# EAGLE schematic fasciaMainBoard_V0.1 (EAGLE 9.5.1)
NOVAXR-MAIN-BOARD: V1; REV: 1

## Sheet 1 of 2
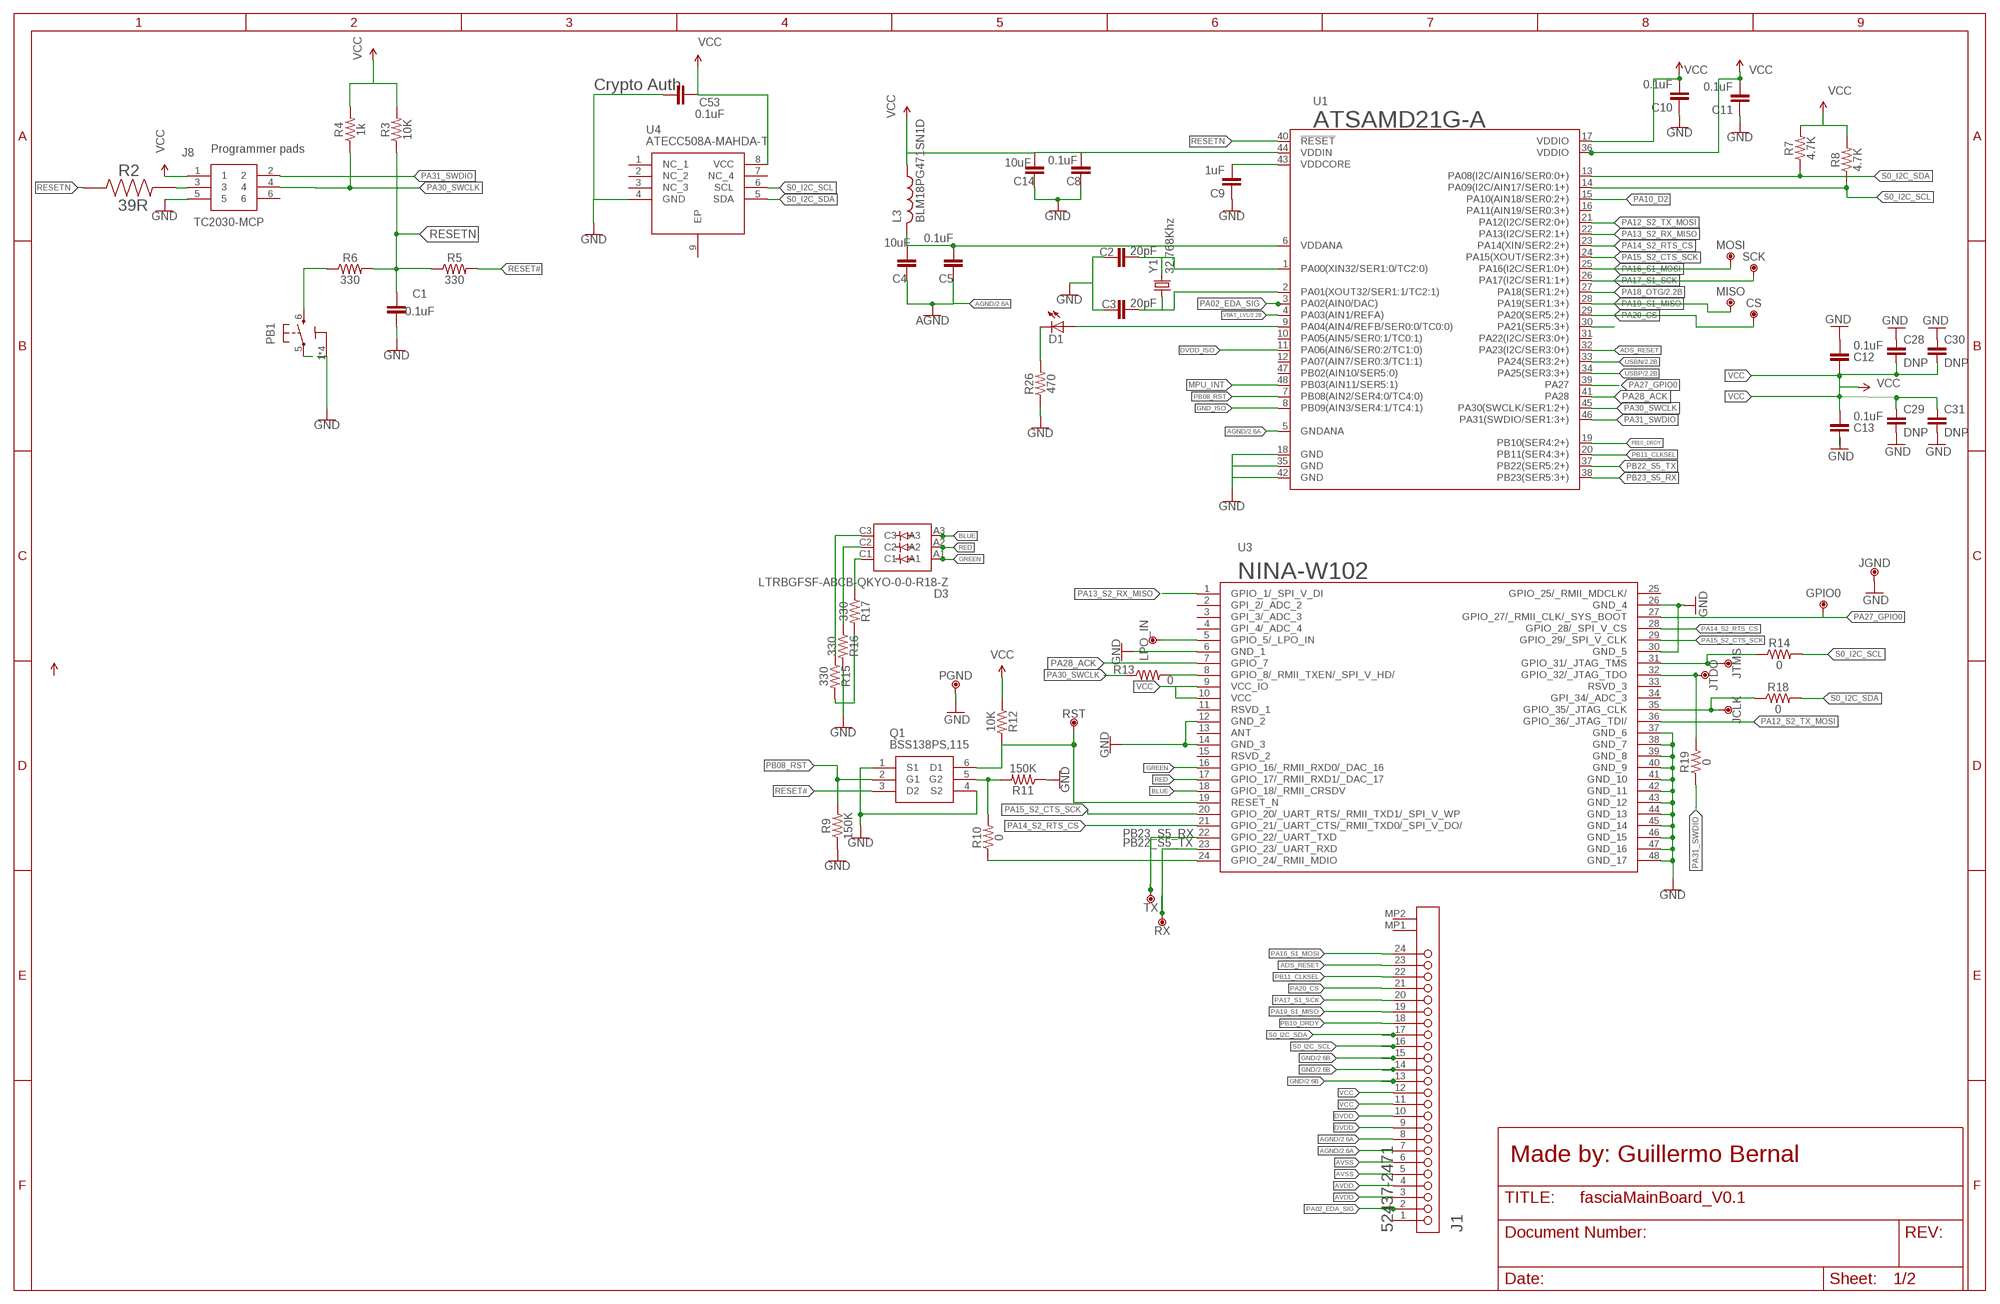
[diagram p0: schematic, sheet 1]
FRAME1 (FRAME_B_L): REV: 0

### Parts
C1  0.1uF  0.1UF-0402T-16V-10%  [0402-TIGHT]
C2  20pF  20PF-0402T-16V-10%  [0402-TIGHT]
C3  20pF  20PF-0402T-16V-10%  [0402-TIGHT]
C4  10uF  10UF-0603-6.3V-20%  [0603]
C5  0.1uF  0.1UF-0402T-16V-10%  [0402-TIGHT]
C8  0.1uF  0.1UF-0402T-16V-10%  [0402-TIGHT]
C9  1uF  1UF-0402T-16V-10%  [0402-TIGHT]
C10  0.1uF  0.1UF-0402T-16V-10%  [0402-TIGHT]
C11  0.1uF  0.1UF-0402T-16V-10%  [0402-TIGHT]
C12  0.1uF  0.1UF-0402T-16V-10%  [0402-TIGHT]
C13  0.1uF  0.1UF-0402T-16V-10%  [0402-TIGHT]
C14  10uF  10UF-0603-6.3V-20%  [0603]
C28  DNP  CDNP-0402  [0402-1005X55N]
C29  DNP  CDNP-0402  [0402-1005X55N]
C30  DNP  C-DNP-0603  [0603-1608X90N]
C31  DNP  C-DNP-0603  [0603-1608X90N]
C53  0.1uF  0.1UF-0402T-16V-10%  [0402-TIGHT]
CS  DNP  TPTP-0.8MM  [TP-0.8MM]
D1  LEDCHIPLED_0603  [CHIPLED_0603]
D3  LTRBGFSF-ABCB-QKYO-0-0-R18-Z  [PLCC-6]
GPIO0  DNP  TPTP-0.8MM  [TP-0.8MM]
J1  MOLEX_52437-2471MOLEX_52437-2471_0_0  [MOLEX_52437-2471_0]
J8  TC2030-MCP  [TC2030MCP]
JCLK  DNP  TPTP-0.8MM  [TP-0.8MM]
JGND  DNP  TPTP-0.8MM  [TP-0.8MM]
JTDO  DNP  TPTP-0.8MM  [TP-0.8MM]
JTMS  DNP  TPTP-0.8MM  [TP-0.8MM]
L3  BLM18PG471SN1D  [BEADC1608X95N]
LPO_IN  DNP  TPTP-0.8MM  [TP-0.8MM]
MISO  DNP  TPTP-0.8MM  [TP-0.8MM]
MOSI  DNP  TPTP-0.8MM  [TP-0.8MM]
PB1  PTS820  TACTILE1PTS820-NH  [C&K_PTS820_NO_HOLES]
PGND  DNP  TPTP-0.8MM  [TP-0.8MM]
Q1  BSS138PS,115  [SOT65P210X110-6N]
R2  39R  RC0402FR-0739RL  [RESC1005X40N]
R3  10K  [0402-TIGHT]
R4  1k  1K  [0402-TIGHT]
R5  330  [0402-TIGHT]
R6  330  [0402-TIGHT]
R7  4.7K  [0402-TIGHT]
R8  4.7K  [0402-TIGHT]
R9  150K  100K  [0402-TIGHT]
R10  0  [0402-TIGHT]
R11  150K  100K  [0402-TIGHT]
R12  10K  [0402-TIGHT]
R13  0  [0402-TIGHT]
R14  0  [0402-TIGHT]
R15  330  [0402-TIGHT]
R16  330  [0402-TIGHT]
R17  330  [0402-TIGHT]
R18  0  [0402-TIGHT]
R19  0  [0402-TIGHT]
R26  470  [0402-TIGHT]
RST  DNP  TPTP-0.8MM  [TP-0.8MM]
RX  DNP  TPTP-0.8MM  [TP-0.8MM]
SCK  DNP  TPTP-0.8MM  [TP-0.8MM]
TX  DNP  TPTP-0.8MM  [TP-0.8MM]
U1  ATSAMD21G-A  [TQFP-48]
U3  NINA-W102  [NINAW102]
U4  ATECC508A-MAHDA-T  [SON50P300X200X60-9N]
Y1  32.768Khz  ECS-.327-12.5-34B-TR  [ECX-31B]

### Nets
ADS_RESET: J1.23 U1.32(PA23(I2C/SER3:0+))
AGND: C4.1 C5.1 J1.7 J1.8 U1.5(GNDANA) ; also sheet 2
AVDD: J1.3 J1.4 ; also sheet 2
AVSS: J1.5 J1.6 ; also sheet 2
BLUE: D3.A3 U3.18(GPIO_18/_RMII_CRSDV)
DVDD: J1.9 J1.10 ; also sheet 2
DVDD_ISO: U1.11(PA06(AIN6/SER0:2/TC1:0))
GND: C1.2 C2.1 C3.1 C8.1 C9.1 C10.1 C11.1 C12.2 C13.1 C14.1 C28.1 C29.2 C30.1 C31.2 C53.2 J1.13 J1.14 J1.15 J8.5 JGND.X PB1.1 PB1.2 PB1.3 PB1.4 PB1.5 PGND.X Q1.1(S1) Q1.4(S2) R9.1 R11.1 R15.2 R16.2 R17.2 R26.1 U1.18(GND) U1.35(GND) U1.42(GND) U3.6(GND_1) U3.12(GND_2) U3.14(GND_3) U3.26(GND_4) U3.30(GND_5) U3.37(GND_6) U3.38(GND_7) U3.39(GND_8) U3.40(GND_9) U3.41(GND_10) U3.42(GND_11) U3.43(GND_12) U3.44(GND_13) U3.45(GND_14) U3.46(GND_15) U3.47(GND_16) U3.48(GND_17) U4.4(GND) ; also sheet 2
GND_ISO: U1.8(PB09(AIN3/SER4:1/TC4:1))
GREEN: D3.A1 U3.16(GPIO_16/_RMII_RXD0/_DAC_16)
MPU_INT: U1.48(PB03(AIN11/SER5:1))
N$1: J8.3 R2.2
N$3: PB1.6 R6.1
N$4: C2.2 U1.1(PA00(XIN32/SER1:0/TC2:0)) Y1.2
N$6: C3.2 U1.2(PA01(XOUT32/SER1:1/TC2:1)) Y1.1
N$8: Q1.5(G2) R10.2 R11.2
N$9: R10.1 U3.24(GPIO_24/_RMII_MDIO)
N$10: C9.2 U1.43(VDDCORE)
N$11: R13.2 U3.8(GPIO_8/_RMII_TXEN/_SPI_V_HD/)
N$12: Q1.6(D1) R12.2 RST.X U3.19(RESET_N)
N$13: D1.C R26.2
N$15: D1.A U1.9(PA04(AIN4/REFB/SER0:0/TC0:0))
N$16: D3.C1 R17.1
N$17: D3.C2 R16.1
N$18: D3.C3 R15.1
N$19: JTMS.X R14.1 U3.31(GPIO_31/_JTAG_TMS)
N$20: JTDO.X R19.2 U3.32(GPIO_32/_JTAG_TDO)
N$21: JCLK.X R18.1 U3.35(GPIO_35/_JTAG_CLK)
N$23: LPO_IN.X U3.5(GPIO_5/_LPO_IN)
PA02_EDA_SIG: J1.2 U1.3(PA02(AIN0/DAC))
PA10_D2: U1.15(PA10(AIN18/SER0:2+))
PA12_S2_TX_MOSI: U1.21(PA12(I2C/SER2:0+)) U3.36(GPIO_36/_JTAG_TDI/)
PA13_S2_RX_MISO: U1.22(PA13(I2C/SER2:1+)) U3.1(GPIO_1/_SPI_V_DI)
PA14_S2_RTS_CS: U1.23(PA14(XIN/SER2:2+)) U3.21(GPIO_21/_UART_CTS/_RMII_TXD0/_SPI_V_DO/) U3.28(GPIO_28/_SPI_V_CS)
PA15_S2_CTS_SCK: U1.24(PA15(XOUT/SER2:3+)) U3.20(GPIO_20/_UART_RTS/_RMII_TXD1/_SPI_V_WP) U3.29(GPIO_29/_SPI_V_CLK)
PA16_S1_MOSI: J1.24 MOSI.X U1.25(PA16(I2C/SER1:0+))
PA17_S1_SCK: J1.20 SCK.X U1.26(PA17(I2C/SER1:1+))
PA18_OTG: U1.27(PA18(SER1:2+)) ; also sheet 2
PA19_S1_MISO: J1.19 MISO.X U1.28(PA19(SER1:3+))
PA20_CS: CS.X J1.21 U1.29(PA20(SER5:2+))
PA21_CS1: U1.30(PA21(SER5:3+))
PA27_GPIO0: GPIO0.X U1.39(PA27) U3.27(GPIO_27/_RMII_CLK/_SYS_BOOT)
PA28_ACK: U1.41(PA28) U3.7(GPIO_7)
PA30_SWCLK: J8.4 R4.1 R13.1 U1.45(PA30(SWCLK/SER1:2+))
PA31_SWDIO: J8.2 R19.1 U1.46(PA31(SWDIO/SER1:3+))
PB08_RST: Q1.2(G1) R9.2 U1.7(PB08(AIN2/SER4:0/TC4:0))
PB10_DRDY: J1.18 U1.19(PB10(SER4:2+))
PB11_CLKSEL: J1.22 U1.20(PB11(SER4:3+))
PB22_S5_TX: RX.X U1.37(PB22(SER5:2+)) U3.23(GPIO_23/_UART_RXD)
PB23_S5_RX: TX.X U1.38(PB23(SER5:3+)) U3.22(GPIO_22/_UART_TXD)
RED: D3.A2 U3.17(GPIO_17/_RMII_RXD1/_DAC_17)
RESET#: Q1.3(D2) R5.2
RESETN: C1.1 R2.1 R3.1 R5.1 R6.2 U1.40(!RESET!)
S0_I2C_SCL: J1.16 R8.1 R14.2 U1.14(PA09(I2C/AIN17/SER0:1+)) U4.6(SCL)
S0_I2C_SDA: J1.17 R7.1 R18.2 U1.13(PA08(I2C/AIN16/SER0:0+)) U4.5(SDA)
USBN: U1.33(PA24(SER3:2+)) ; also sheet 2
USBP: U1.34(PA25(SER3:3+)) ; also sheet 2
VBAT_LVL: U1.4(PA03(AIN1/REFA)) ; also sheet 2
VCC: C8.2 C10.2 C11.2 C12.1 C13.2 C14.2 C28.2 C29.1 C30.2 C31.1 C53.1 J1.11 J1.12 J8.1 L3.1 R3.2 R4.2 R7.2 R8.2 R12.1 U1.17(VDDIO) U1.36(VDDIO) U1.44(VDDIN) U3.9(VCC_IO) U3.10(VCC) U4.8(VCC) ; also sheet 2
VDDANA: C4.2 C5.2 L3.2 U1.6(VDDANA)
Unconnected: J1.1 J1.MP1 J1.MP2 J8.6 U1.10(PA05(AIN5/SER0:1/TC0:1)) U1.12(PA07(AIN7/SER0:3/TC1:1)) U1.16(PA11(AIN19/SER0:3+)) U1.31(PA22(I2C/SER3:0+)) U1.47(PB02(AIN10/SER5:0)) U3.2(GPI_2/_ADC_2) U3.3(GPI_3/_ADC_3) U3.4(GPI_4/_ADC_4) U3.11(RSVD_1) U3.13(ANT) U3.15(RSVD_2) U3.25(GPIO_25/_RMII_MDCLK/) U3.33(RSVD_3) U3.34(GPI_34/_ADC_3) U4.1(NC_1) U4.2(NC_2) U4.3(NC_3) U4.7(NC_4) U4.9(EP)

### Notes on the sheet
- Crypto Auth
- Programmer pads
- Made by: Guillermo Bernal

## Sheet 2 of 2
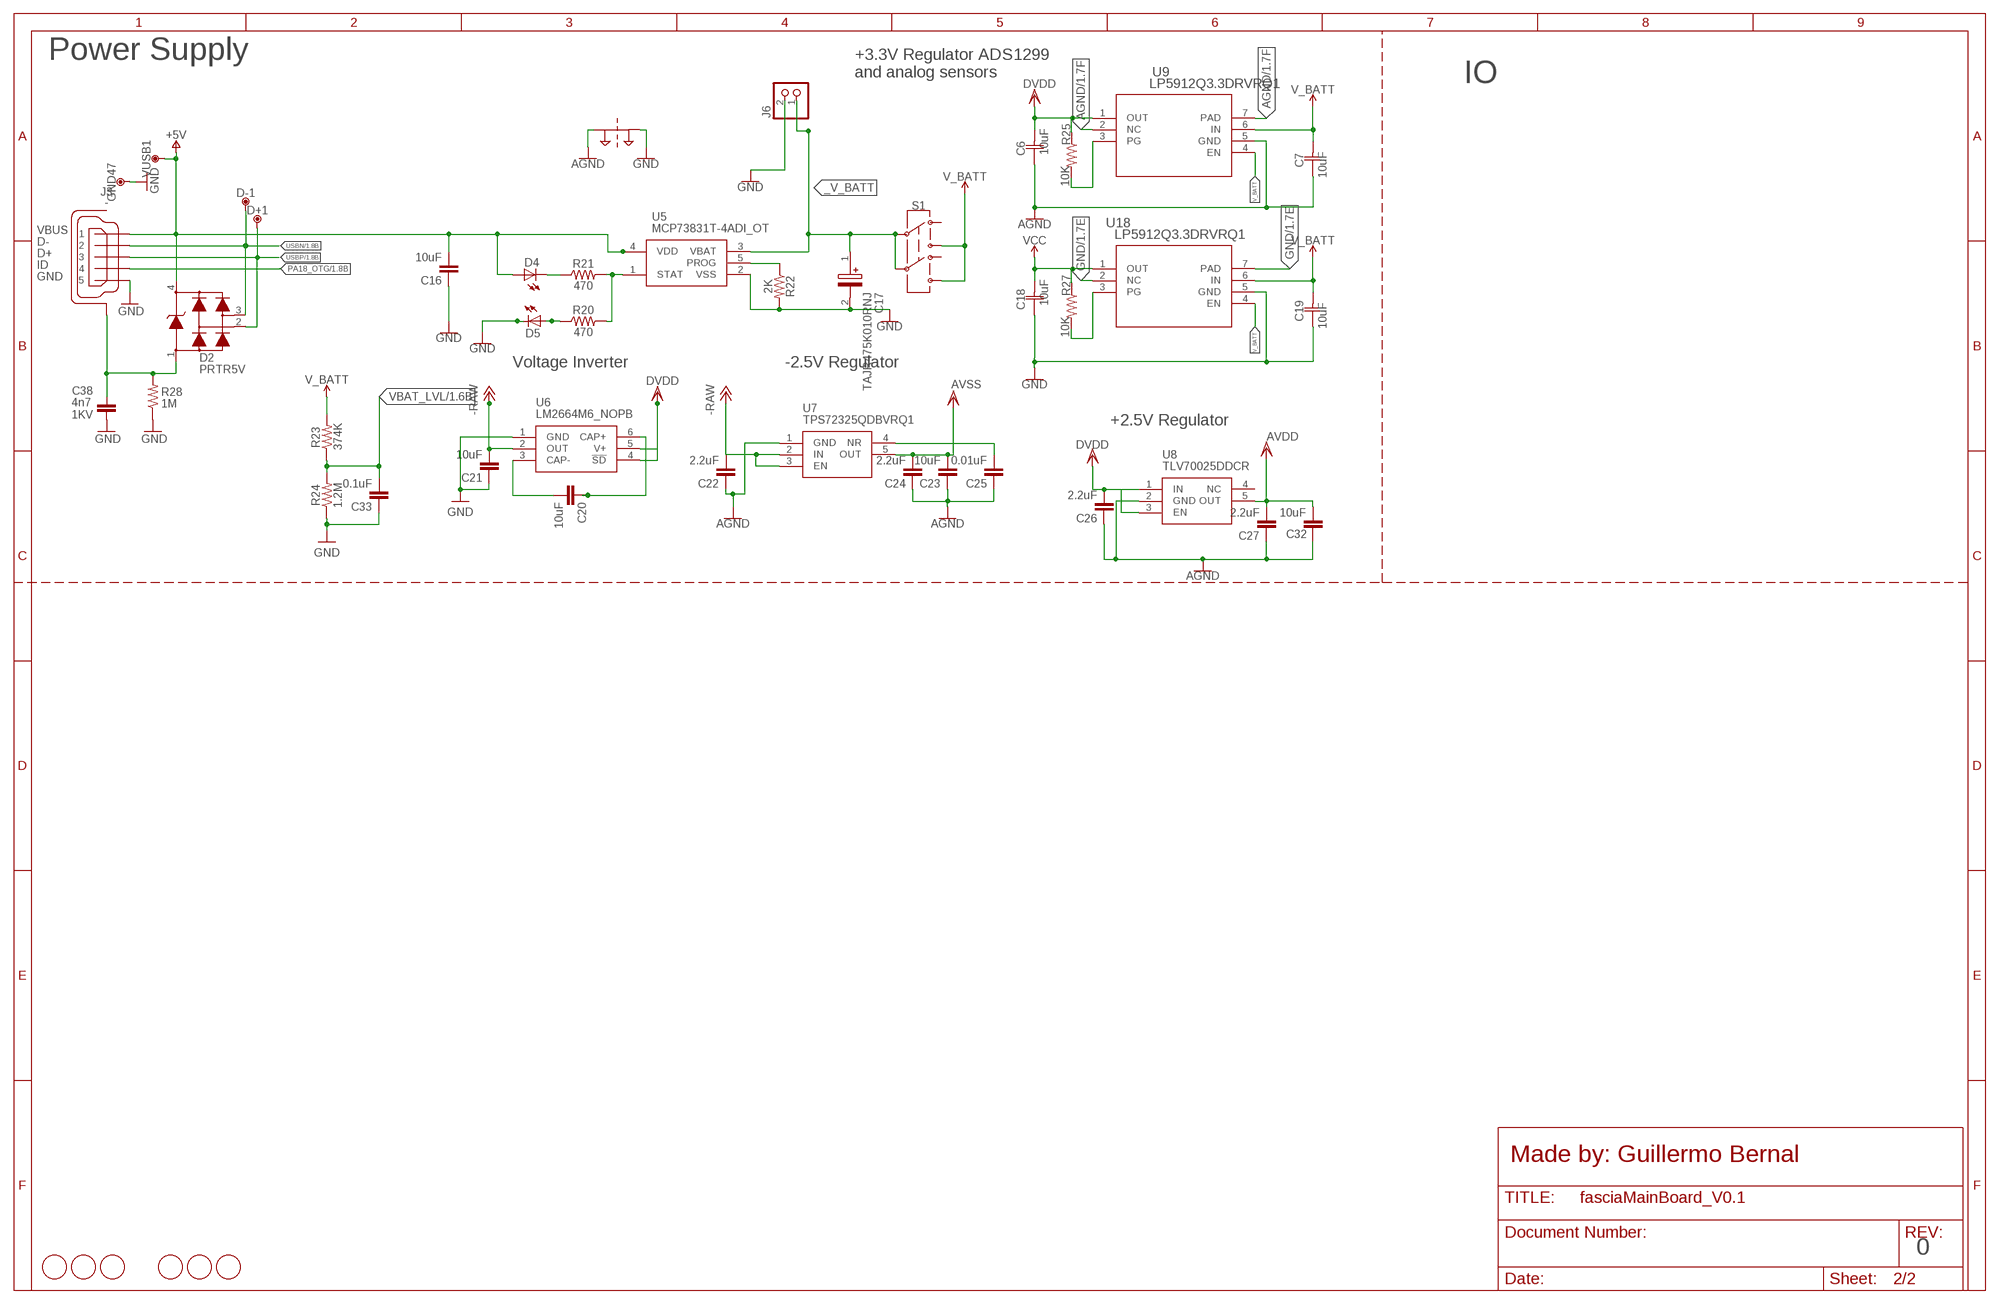
[diagram p1: schematic, sheet 2]
FRAME2 (FRAME_B_L): REV: 0

### Parts
C6  10uF  CL10B106MQ8NRNCCAP_CL10-L  [CAP_CL10-L]
C7  10uF  CL10B106MQ8NRNCCAP_CL10-L  [CAP_CL10-L]
C16  10uF  10UF-0603-6.3V-20%  [0603]
C17  TAJR475K010RNJ  [CAPPM2014X120N]
C18  10uF  CL10B106MQ8NRNCCAP_CL10-L  [CAP_CL10-L]
C19  10uF  CL10B106MQ8NRNCCAP_CL10-L  [CAP_CL10-L]
C20  10uF  10UF-0603-6.3V-20%  [0603]
C21  10uF  10UF-0603-6.3V-20%  [0603]
C22  2.2uF  2.2UF-0402T-16V-10%  [0402-TIGHT]
C23  10uF  10UF-0603-6.3V-20%  [0603]
C24  2.2uF  2.2UF-0402T-16V-10%  [0402-TIGHT]
C25  0.01uF  0.01UF-0402T-16V-10%  [0402-TIGHT]
C26  2.2uF  2.2UF-0402T-16V-10%  [0402-TIGHT]
C27  2.2uF  2.2UF-0402T-16V-10%  [0402-TIGHT]
C32  10uF  10UF-0603-6.3V-20%  [0603]
C33  0.1uF  0.1UF-0402T-16V-10%  [0402-TIGHT]
C38  4n7  C4.7NF-0805  [0805-R2013X50N]
D2  PRTR5V  PRTR5V0U2X,215  [SOT190P230X110-4N]
D4  LEDCHIPLED_0603  [CHIPLED_0603]
D5  LEDCHIPLED_0603  [CHIPLED_0603]
D+1  DNP  TPTP-1.00MM  [TP-1.00MM]
D-1  DNP  TPTP-1.00MM  [TP-1.00MM]
FD1  DNP  FIDUCIAL-1.5MM  [FD-1-1.5]
FD2  DNP  FIDUCIAL-1.5MM  [FD-1-1.5]
FD3  DNP  FIDUCIAL-1.5MM  [FD-1-1.5]
FD4  DNP  FIDUCIAL-1.5MM  [FD-1-1.5]
FD5  DNP  FIDUCIAL-1.5MM  [FD-1-1.5]
FD6  DNP  FIDUCIAL-1.5MM  [FD-1-1.5]
GND47  DNP  TPTP-1.00MM  [TP-1.00MM]
J3  -  USB-MICRO  [ZX62-AB-5PA]
J6  JST_2PIN-SMT-RA  [JST-PH-2-SMT-RA]
R20  470  [0402-TIGHT]
R21  470  [0402-TIGHT]
R22  2K  [0402-TIGHT]
R23  374K  [0402-TIGHT]
R24  1.2M  1.2M-0402-1/10W-1%  [0402]
R25  10K  [0402-TIGHT]
R27  10K  [0402-TIGHT]
R28  1M  [0402-TIGHT]
S1  SWITCH-DPDT-SMD-AYZ0202  [SWITCH_DPDT_SMD_AYZ0202]
SUPPLY1  2PT_GND_TIE  [2PT_GND_TIE]
U5  MCP73831T-4ADI_OT  [SOT95P270X145-5N]
U6  LM2664M6_NOPB  [SOT95P280X145-6N]
U7  TPS72325QDBVRQ1  [SOT96P230X110-5N]
U8  TLV70025DDCR  [SOT95P280X110-5N]
U9  LP5912Q3.3DRVRQ1  [DRV0006A]
U18  LP5912Q3.3DRVRQ1  [DRV0006A]
VUSB1  DNP  TPTP-1.00MM  [TP-1.00MM]

### Nets
+5V: C16.2 D2.4 D4.A J3.1 U5.4(VDD) VUSB1.X
-RAW: C21.2 C22.2 U6.2(OUT) U7.2(IN) U7.3(EN)
_V_BATT: C17.1(+) J6.1 S1.2 S1.5 U5.3(VBAT)
AGND: C6.1 C7.1 C22.1 C23.1 C24.1 C25.1 C26.1 C27.1 C32.1 SUPPLY1.P$1 U7.1(GND) U8.2(GND) U9.2(NC) U9.5(GND) U9.7(PAD) ; also sheet 1
AVDD: C27.2 C32.2 U8.5(OUT) ; also sheet 1
AVSS: C23.2 C24.2 U7.5(OUT) ; also sheet 1
DVDD: C6.2 C26.2 R25.1 U6.4(!SD) U6.5(V+) U8.1(IN) U8.3(EN) U9.1(OUT) ; also sheet 1
GND: C16.1 C17.2(-) C18.1 C19.1 C21.1 C33.1 C38.2 D5.C GND47.X J3.5 J6.2 R22.2 R24.1 R28.1 SUPPLY1.P$2 U5.2(VSS) U6.1(GND) U18.2(NC) U18.5(GND) U18.7(PAD) ; also sheet 1
N$2: R27.2 U18.3(PG)
N$7: R25.2 U9.3(PG)
N$25: D4.C R21.1
N$28: R20.2 R21.2 U5.1(STAT)
N$30: R22.1 U5.5(PROG)
N$31: C20.2 U6.3(CAP-)
N$32: C20.1 U6.6(CAP+)
N$33: C25.2 U7.4(NR)
N$40: C38.1 D2.1 J3.6(SH) J3.7(SH) J3.8(SH) J3.9(SH) J3.10(SH) J3.11(SH) R28.2
N$42: D5.A R20.1
PA18_OTG: J3.4 ; also sheet 1
USBN: D2.3 D-1.X J3.2 ; also sheet 1
USBP: D2.2 D+1.X J3.3 ; also sheet 1
V_BATT: C7.2 C19.2 R23.2 S1.3 S1.6 U9.4(EN) U9.6(IN) U18.4(EN) U18.6(IN)
VBAT_LVL: C33.2 R23.1 R24.2 ; also sheet 1
VCC: C18.2 R27.1 U18.1(OUT) ; also sheet 1
Unconnected: S1.1 S1.4 U8.4(NC)

### Notes on the sheet
- Power Supply
- +3.3V Regulator ADS1299 
  and analog sensors
- IO
- Voltage Inverter | -2.5V Regulator
- +2.5V Regulator
- 374K
- Made by: Guillermo Bernal

## Library data of the parts
C1 C5 C8 C10-C13 C33 C53 = novaXR:0.1UF: 0.1µF ceramic capacitors A capacitor is a passive two-terminal electrical component used to store electrical energy temporarily in an electric field.; PROD_ID: CAP-12416
C2 C3 = novaXR:20PF: 20pF ceramic capacitors A capacitor is a passive two-terminal electrical component used to store electrical energy temporarily in an electric field.; PROD_ID: CAP-12416; VALUE: 0.1uF
C4 C14 C16 C20 C21 C23 C32 = SparkFun-Capacitors:10UF: 10.0µF ceramic capacitors A capacitor is a passive two-terminal electrical component used to store electrical energy temporarily in an electric field.; PROD_ID: CAP-11015
C6 C7 C18 C19 = Lp5912Q3.3DRV:CL10B106MQ8NRNC; MANUFACTURER_PART_NUMBER: CL10B106MQ8NRNC; VENDOR: Samsung
C9 = novaXR:1UF: 1µF ceramic capacitors A capacitor is a passive two-terminal electrical component used to store electrical energy temporarily in an electric field.; PROD_ID: CAP-12416
C17 = SamacSys_Parts:TAJR475K010RNJ: AVX 4.7uF SMD Solid MnO2 Tantalum Electrolytic Capacitor, 10 V dc +/-10%, TAJ Series Source: Datasheet <http://www.farnell.com/datasheets/1680476.pdf>; ALLIED_NUMBER: 70475142; ALLIED_PRICE-STOCK: https://www.alliedelec.com/avx-tajr475k010rnj/70475142/; DESCRIPTION: AVX 4.7uF SMD Solid MnO2 Tantalum Electrolytic Capacitor, 10 V dc +/-10%, TAJ Series; HEIGHT: 1.2mm; MANUFACTURER_NAME: AVX; MANUFACTURER_PART_NUMBER: TAJR475K010RNJ; MOUSER_PART_NUMBER: 581-TAJR475K010R; MOUSER_PRICE-STOCK: https://www.mouser.com/Search/Refine.aspx?Keyword=581-TAJR475K010R; RS_PART_NUMBER: 1355409P; RS_PRICE-STOCK: http://uk.rs-online.com/web/p/products/1355409P
C22 C24 C26 C27 = novaXR:2.2UF: 2.2uF ceramic capacitors A capacitor is a passive two-terminal electrical component used to store electrical energy temporarily in an electric field.; PROD_ID: CAP-12416
C25 = novaXR:0.01UF: 0.01µF ceramic capacitors A capacitor is a passive two-terminal electrical component used to store electrical energy temporarily in an electric field.; PROD_ID: CAP-12416
C28-C31 = Arduino-rcl:C: SMD Capacitor; CODE-ARDUINO: DNP; DATASHEET: DNP; DISTRIBUTOR-LINK: DNP; DISTRIBUTOR-PN: DNP; MANUFACTURER: DNP; MANUFACTURER-PN: DNP
C38 = Arduino-rcl:C: SMD Capacitor; CODE-ARDUINO: 0689; DATASHEET: http://www.kemet.com/Lists/ProductCatalog/Attachments/40/KEM_C1010_X7R_HV_SMD.pdf; DISTRIBUTOR-LINK: www.kemet.com/docfinder?Partnumber=C0805C472KDRACTU; DISTRIBUTOR-PN: 399-6738-1-ND; MANUFACTURER: Kemet; MANUFACTURER-PN: C0805C472KDRACTU; VOLTAGE: 1KV
CS D+1 D-1 GND47 GPIO0 JCLK JGND JTDO JTMS LPO_IN MISO MOSI PGND RST RX SCK TX VUSB1 = Arduino-utility:TP: Testpoint; CODE-ARDUINO: DNP; DATASHEET: DNP; DISTRIBUTOR-LINK: DNP; DISTRIBUTOR-PN: DNP; MANUFACTURER: DNP; MANUFACTURER-PN: DNP
D1 D4 D5 = adafruit:LED: LED OSRAM: - CHIPLED LG R971, LG N971, LY N971, LG Q971, LY Q971, LO R971, LY R971 LH N974, LH R974 LS Q976, LO Q976, LY Q976 LO Q996 - Hyper CHIPLED LW Q18S LB Q993, LB Q99A, LB R99A - SideLED LS A670, LO A670, LY A670, LG A670, LP A670 LB A673, LV A673, LT A673, LW A673 LH A674 LY A675 LS A676, LA A676, LO A676, LY A676, LW A676 LS A679, LY A679, LG A679 - Hyper Micro SIDELED® LS Y876, LA Y876, LO Y876, LY Y876 LT Y87S - SmartLED LW L88C, LW L88S LB L89C, LB L89S, LG L890 LS L89K, LO L89K, LY L89K LS L896, LA L896, LO L896, LY L896 - TOPLED LS T670, LO T670, LY T670, LG T670, LP T670 LSG T670, LSP T670, LSY T670, LOP T670, LYG T670 LG T671, LOG T671, LSG T671 LB T673, LV T673, LT T673, LW T673 LH T674 LS T676, LA T676, LO T676, LY T676, LB T676, LH T676, LSB T676, LW T676 LB T67C, LV T67C, LT T67C, LS T67K, LO T67K, LY T67K, LW E67C LS E67B, LA E67B, LO E67B, LY E67B, LB E67C, LV E67C, LT E67C LW T67C LS T679, LY T679, LG T679 LS T770, LO T770, LY T770, LG T770, LP T770 LB T773, LV T773, LT T773, LW T773 LH T774 LS E675, LA E675, LY E675, LS T675 LS T776, LA T776, LO T776, LY T776, LB T776 LHGB T686 LT T68C, LB T68C - Hyper Mini TOPLED® LB M676 - Mini TOPLED Santana® LG M470 LS M47K, LO M47K, LY M47K Source: http://www.osram.convergy.de/
D2 = Arduino-diodes:PRTR5V0U2X,215: USB ESD protection; CODE-ARDUINO: 2209; DATASHEET: http://www.nxp.com/documents/data_sheet/PRTR5V0U2X.pdf; DISTRIBUTOR-LINK: http://www.digikey.com/product-detail/en/nxp-semiconductors/PRTR5V0U2X,215/568-4140-1-ND/1589981; DISTRIBUTOR-PN: 568-4140-1-ND; MANUFACTURER: NXP; MANUFACTURER-PN: PRTR5V0U2X,215
D3 = SamacSys_Parts:LTRBGFSF-ABCB-QKYO-0-0-R18-Z: LED RGB DIFFUSED 6SMD Source: Datasheet <https://dammedia.osram.info/media/resource/hires/osram-dam-2493400/LTRB GFSF.pdf>; DESCRIPTION: LED RGB DIFFUSED 6SMD; HEIGHT: mm; MANUFACTURER_NAME: OSRAM Opto Semiconductors; MANUFACTURER_PART_NUMBER: LTRBGFSF-ABCB-QKYO-0-0-R18-Z; MOUSER_PART_NUMBER: N/A; MOUSER_PRICE-STOCK: https://www.mouser.com/Search/Refine.aspx?Keyword=N%2FA
FD1-FD6 = Arduino-utility:FIDUCIAL: Fiducial mount; CODE-ARDUINO: DNP; DATASHEET: DNP; DISTRIBUTOR-LINK: DNP; DISTRIBUTOR-PN: DNP; MANUFACTURER: DNP; MANUFACTURER-PN: DNP
J1 = Molex - 52437-2471:MOLEX_52437-2471: MOLX-52437-2471; CIIVA_IDS: 605212; CIRCUITS_LOADED: 24; COMPONENT_LINK_1_DESCRIPTION: Manufacturer URL; COMPONENT_LINK_1_URL: http://www.molex.com/molex/index.jsp; COMPONENT_LINK_3_DESCRIPTION: Package Specification; COMPONENT_LINK_3_URL: http://www.molex.com/pdm_docs/sd/524372471_sd.pdf; CONTACT_POSITION: Bottom; CURRENT_MAX_PER_CONTACT: 0.5A; DATASHEET: http://www.molex.com/webdocs/datasheets/pdf/en-us/0524372471_FFC_FPC_CONNECTORS.pdf; DURABILITY_MATING_CYCLES_MAX: 20; ENTRY_ANGLE: 90degrees Angle; FOOTPRINT_VARIANT_NAME_0: Manufacturer Recommended; IMPORTED: yes; IMPORTED_FROM: vault; IMPORT_TS: 1521869192; MATERIAL___METAL: Phosphor Bronze; MATERIAL___PLATING_MATING: Gold; MATERIAL___PLATING_TERMINATION: Gold; MF: Molex; MOUNTING_TECHNOLOGY: Surface Mount; MPN: 52437-2471; NUMBER_OF_ROWS: 1; ORIENTATION: Right Angle; PACKAGE: 52437-2471; PACKAGE_DESCRIPTION: 24-Lead FPC Connector, Pitch 0.5 mm; PACKAGE_VERSION: Rev. E, 07/2013; PACKING: Tape and Reel; PCB_LOCATOR: No; PCB_RETENTION: None; PITCH___MATING_INTERFACE: 0.50mm; POLARIZED_TO_PCB: Yes; PREFIX: J; RELEASE_DATE: 1411372502; ROHS: Yes; STACKABLE: No; VAULT_GUID: C435F480-C5D6-47A9-8B3E-1F527B5FE02A; VAULT_REVISION: D1E34D73-9D44-46B4-956C-D39459EFC8BE; VOLTAGE_MAX: 50V
J3 = Arduino-connectors:USB-MICRO: USB - micro AB USB 2.0 Receptacle Connector 5 Position Surface Mount, Right Angle, Horizontal; CODE-ARDUINO: 2219; DATASHEET: https://www.hirose.com/product/en/download_file/key_name/ZX/category/Catalog/doc_file_id/31704/?file_category_id=4&item_id=13&is_series=1; DISTRIBUTOR-LINK: http://www.digikey.com/product-detail/en/hirose-electric-co-ltd/ZX62-AB-5PA(31)/H125279CT-ND/5994741; DISTRIBUTOR-PN: H125279CT-ND; MANUFACTURER: Hirose; MANUFACTURER-PN: ZX62-AB-5PA(31)
J6 = adafruit:JST_2PIN: JST 2-Pin Connectors of various flavors SMT-RA (S2B-PH-SM4) 4UConnector #17311 SMT (B2B-PH-SM4) THM-RA (S2B-PH) THM (B2B-PH)
J8 = TC2030-MCP:TC2030-MCP: TC2030-MCP PCB FOOTPRINT,TC2030-MCP Source: Datasheet <http://ww1.microchip.com/downloads/en/DeviceDoc/TC2030-MCP_PCB_Footprint_RevD.pdf>; ALLIED_NUMBER: 70547380; ALLIED_PRICE-STOCK: https://www.alliedelec.com/microchip-technology-inc-tc2030-mcp/70547380/; DESCRIPTION: TC2030-MCP PCB FOOTPRINT,TC2030-MCP; HEIGHT: 3mm; MANUFACTURER_NAME: Microchip; MANUFACTURER_PART_NUMBER: TC2030-MCP; MOUSER_PART_NUMBER: 579-TC2030-MCP; MOUSER_PRICE-STOCK: https://www.mouser.com/Search/Refine.aspx?Keyword=579-TC2030-MCP; RS_PART_NUMBER: 8252568; RS_PRICE-STOCK: http://uk.rs-online.com/web/p/products/8252568
L3 = SamacSys_Parts:BLM18PG471SN1D: Chip Ferrite Bead Source: Datasheet <http://docs-emea.rs-online.com/webdocs/13d6/0900766b813d688f.pdf>; DESCRIPTION: Chip Ferrite Bead; HEIGHT: 0.95mm; MANUFACTURER_NAME: Murata Electronics; MANUFACTURER_PART_NUMBER: BLM18PG471SN1D; MOUSER_PART_NUMBER: 81-BLM18PG471SN1D; MOUSER_PRICE-STOCK: https://www.mouser.com/Search/Refine.aspx?Keyword=81-BLM18PG471SN1D; RS_PART_NUMBER: 7241425P; RS_PRICE-STOCK: http://uk.rs-online.com/web/p/products/7241425P
PB1 = Arduino-pushbuttons:TACTILE1: Tactile Switch SPST-NO Top Actuated Surface Mount; CODE-ARDUINO: 0277; DATASHEET: http://www.ckswitches.com/media/1474/pts820.pdf; DISTRIBUTOR-LINK: https://www.digikey.com/product-detail/en/c-k/PTS820-J15M-SMTR-LFS/CKN10506CT-ND/4176681; DISTRIBUTOR-PN: PTS820 J25K SMTR LFS-ND; MANUFACTURER: C&K; MANUFACTURER-PN: PTS820 J25K SMTR LFS
Q1 = SamacSys_Parts:BSS138PS,115: Nexperia BSS138PS,115 Dual N-channel MOSFET, 320 mA, 60 V, 6-Pin SOT-363 Source: Datasheet <https://assets.nexperia.com/documents/data-sheet/BSS138PS.pdf>; DESCRIPTION: Nexperia BSS138PS,115 Dual N-channel MOSFET, 320 mA, 60 V, 6-Pin SOT-363; HEIGHT: 1.1mm; MANUFACTURER_NAME: Nexperia; MANUFACTURER_PART_NUMBER: BSS138PS,115; MOUSER_PART_NUMBER: 771-BSS138PS115; MOUSER_PRICE-STOCK: https://www.mouser.com/Search/Refine.aspx?Keyword=771-BSS138PS115; RS_PART_NUMBER: 7920901P; RS_PRICE-STOCK: http://uk.rs-online.com/web/p/products/7920901P
R2 = RC0402FR-0739RL:RC0402FR-0739RL: Res Thick Film 0402 39 Ohm 1% 0.063W ?100ppm/?C Molded SMD Paper T/R; AVAILABILITY: Unavailable; DESCRIPTION: Surface Mount Thick Film Resistor, RC Series, 39 ohm, 63 mW, - 1%, 50 V, 0402 [1005 Metric]; MF: Yageo; MP: RC0402FR-0739RL; PACKAGE: 1005 Panasonic Electronic Components; PRICE: None
R3 R12 R25 R27 = novaXR:10K: 10KΩ resistor A resistor is a passive two-terminal electrical component that implements electrical resistance as a circuit element. Resistors act to reduce current flow, and, at the same time, act to lower voltage levels within circuits. - Wikipedia
R4 = novaXR:1K: 1KΩ resistor A resistor is a passive two-terminal electrical component that implements electrical resistance as a circuit element. Resistors act to reduce current flow, and, at the same time, act to lower voltage levels within circuits. - Wikipedia
R5 R6 R15-R17 = novaXR:330: 330Ω resistor A resistor is a passive two-terminal electrical component that implements electrical resistance as a circuit element. Resistors act to reduce current flow, and, at the same time, act to lower voltage levels within circuits. - Wikipedia
R7 R8 = novaXR:4.7K: 4.7KΩ resistor A resistor is a passive two-terminal electrical component that implements electrical resistance as a circuit element. Resistors act to reduce current flow, and, at the same time, act to lower voltage levels within circuits. - Wikipedia
R9 R11 = novaXR:100K: 150KΩ resistor A resistor is a passive two-terminal electrical component that implements electrical resistance as a circuit element. Resistors act to reduce current flow, and, at the same time, act to lower voltage levels within circuits. - Wikipedia
R10 R13 R14 R18 R19 = novaXR:0: 0Ω resistor A resistor is a passive two-terminal electrical component that implements electrical resistance as a circuit element. Resistors act to reduce current flow, and, at the same time, act to lower voltage levels within circuits. - Wikipedia
R20 R21 R26 = novaXR:470: 470Ω resistor A resistor is a passive two-terminal electrical component that implements electrical resistance as a circuit element. Resistors act to reduce current flow, and, at the same time, act to lower voltage levels within circuits. - Wikipedia
R22 = novaXR:2K: 2KΩ resistor A resistor is a passive two-terminal electrical component that implements electrical resistance as a circuit element. Resistors act to reduce current flow, and, at the same time, act to lower voltage levels within circuits. - Wikipedia
R23 = novaXR:374K: 374KΩ resistor A resistor is a passive two-terminal electrical component that implements electrical resistance as a circuit element. Resistors act to reduce current flow, and, at the same time, act to lower voltage levels within circuits. - Wikipedia
R24 = novaXR:1.2M: 1.2MΩ resistor A resistor is a passive two-terminal electrical component that implements electrical resistance as a circuit element. Resistors act to reduce current flow, and, at the same time, act to lower voltage levels within circuits. - Wikipedia
R28 = novaXR:1M: 1MΩ resistor A resistor is a passive two-terminal electrical component that implements electrical resistance as a circuit element. Resistors act to reduce current flow, and, at the same time, act to lower voltage levels within circuits. - Wikipedia
S1 = SparkFun-Switches:SWITCH-DPDT: Double-Pole, Double-Throw (DPDT) Switch Double-pole, double-throw switches. Variant Overview PTH-GPI-152-3013 Used on SparkFun Geiger Counter <https://www.sparkfun.com/products/11345> SMD-AY0202 Surface Mount DPDT Switch <https://www.sparkfun.com/products/597> (COM-00597) Used on e.g. LilyPad Arduino USB - ATmega32U4 Board <https://www.sparkfun.com/products/12049>; PROD_ID: SWCH-08179; SF_SKU: COM-00597
SUPPLY1 = SparkFun-PowerSymbols:2PT_GND_TIE: Dual Ground Supply Power supply symbol for connecting two grounds. SparkFun Products: SparkFun AutoDriver - Stepper Motor Driver <https://www.sparkfun.com/products/11611>
U1 = SparkFun-IC-Microcontroller:ATSAMD21G: Atmel SAMD21G SMART ARM-Based Microcontroller The Atmel ® | SMART ™ SAM D21 is a series of low-power microcontrollers using the 32-bit ARM ® Cortex ® -M0+ processor, and ranging from 32- to 64-pins with up to 256KB Flash and 32KB of SRAM. The SAM D21 devices operate at a maximum frequency of 48MHz and reach 2.46 CoreMark/MHz. They are designed for simple and intuitive migration with identical peripheral modules, hex compatible code, identical linear address map and pin compatible migration paths between all devices in the product series. All devices include intelligent and flexible peripherals, Atmel Event System for inter-peripheral signaling, and support for capacitive touch button, slider and wheel user interfaces. Datasheet <https://cdn.sparkfun.com/datasheets/Dev/Arduino/Boards/Atmel-42181-SAM-D21_Datasheet.pdf> SparkFun Products SparkFun SAMD21 Mini Breakout <https://www.sparkfun.com/products/13664> (DEV-13664) SparkFun SAMD21 Dev Breakout <https://www.sparkfun.com/products/13672> (DEV-13672); PROD_ID: IC-13064
U3 = SamacSys_Parts:NINA-W102: STAND-ALONE MULTIRADIO MODULE Source: Datasheet <https://www.u-blox.com/sites/default/files/NINA-W10_DataSheet_(UBX-17065507).pdf>; DESCRIPTION: STAND-ALONE MULTIRADIO MODULE; HEIGHT: 3mm; MANUFACTURER_NAME: U-Blox; MANUFACTURER_PART_NUMBER: NINA-W102
U4 = SamacSys_Parts:ATECC508A-MAHDA-T: Microchip ATECC508A-MAHDA-T 10kb 8-Pin Crypto Authentication IC UDFN Source: Datasheet <http://ww1.microchip.com/downloads/en/DeviceDoc/20005927A.pdf>; DESCRIPTION: Microchip ATECC508A-MAHDA-T 10kb 8-Pin Crypto Authentication IC UDFN; HEIGHT: 0.6mm; MANUFACTURER_NAME: Microchip; MANUFACTURER_PART_NUMBER: ATECC508A-MAHDA-T; MOUSER_PART_NUMBER: 556-ATECC508A-MAHDAT; MOUSER_PRICE-STOCK: https://www.mouser.com/Search/Refine.aspx?Keyword=556-ATECC508A-MAHDAT; RS_PART_NUMBER: 1773144P; RS_PRICE-STOCK: http://uk.rs-online.com/web/p/products/1773144P
U5 = SamacSys_Parts:MCP73831T-4ADI_OT: Battery Management Li-Ion/Li-Poly Charg Mgnt 4.4V Vreg out Source: Datasheet <https://componentsearchengine.com/Datasheets/1/MCP73831T-4ADI_OT.pdf>; ALLIED_NUMBER: 70567395; ALLIED_PRICE-STOCK: https://www.alliedelec.com/microchiptechnologyinc-mcp73831t-4adi-ot/70567395/; DESCRIPTION: Battery Management Li-Ion/Li-Poly Charg Mgnt 4.4V Vreg out; HEIGHT: 1.45mm; MANUFACTURER_NAME: Microchip; MANUFACTURER_PART_NUMBER: MCP73831T-4ADI/OT; MOUSER_PART_NUMBER: 579-MCP73831T4ADIOT; MOUSER_PRICE-STOCK: https://www.mouser.com/Search/Refine.aspx?Keyword=579-MCP73831T4ADIOT
U6 = SamacSys_Parts:LM2664M6_NOPB: 1.8V to 5.5Vin Switched Capacitor Voltage Converter Source: Datasheet <http://docs-emea.rs-online.com/webdocs/06e8/0900766b806e83f3.pdf>; DESCRIPTION: 1.8V to 5.5Vin Switched Capacitor Voltage Converter; HEIGHT: 1.45mm; MANUFACTURER_NAME: Texas Instruments; MANUFACTURER_PART_NUMBER: LM2664M6/NOPB; MOUSER_PART_NUMBER: 926-LM2664M6/NOPB; MOUSER_PRICE-STOCK: https://www.mouser.com/Search/Refine.aspx?Keyword=926-LM2664M6%2FNOPB; RS_PART_NUMBER: 5358792P; RS_PRICE-STOCK: http://uk.rs-online.com/web/p/products/5358792P
U7 = SamacSys_Parts:TPS72325QDBVRQ1: Automotive Single Output LDO, 200mA, High PSRR, Low Noise Source: Datasheet <http://www.ti.com/lit/gpn/tps723-q1>; DESCRIPTION: Automotive Single Output LDO, 200mA, High PSRR, Low Noise; HEIGHT: 1.1mm; MANUFACTURER_NAME: Texas Instruments; MANUFACTURER_PART_NUMBER: TPS72325QDBVRQ1
U8 = SamacSys_Parts:TLV70025DDCR: 200-mA, Low-IQ, Low-Dropout Regulator for Portable Devices Source: Datasheet <http://www.ti.com/lit/gpn/tlv700>; DESCRIPTION: 200-mA, Low-IQ, Low-Dropout Regulator for Portable Devices; HEIGHT: mm; MANUFACTURER_NAME: Texas Instruments; MANUFACTURER_PART_NUMBER: TLV70025DDCR; MOUSER_PART_NUMBER: 595-TLV70025DDCR; MOUSER_PRICE-STOCK: https://www.mouser.com/Search/Refine.aspx?Keyword=595-TLV70025DDCR
U9 U18 = Lp5912Q3.3DRV:LP5912Q3.3DRVRQ1
Y1 = SamacSys_Parts:ECS-.327-12.5-34B-TR: Crystals 32.768KHz 20ppm 12.5pF -40C +85C Source: Datasheet <http://www.mouser.com/ds/2/122/ecx-31b-1108368.pdf>; DESCRIPTION: Crystals 32.768KHz 20ppm 12.5pF -40C +85C; HEIGHT: mm; MANUFACTURER_NAME: ECS; MANUFACTURER_PART_NUMBER: ECS-.327-12.5-34B-TR; MOUSER_PART_NUMBER: 520-327-12.5-34B; MOUSER_PRICE-STOCK: https://www.mouser.com/Search/Refine.aspx?Keyword=520-327-12.5-34B

## Net classes
0 default: width 0.19 mm, drill 0.19 mm
1 usb: width 0.19 mm, drill 0.19 mm, clearance 0.127 mm